# Altium schematic sheet LEDs.SchDoc
size A; SheetNumber: 5; SheetTotal: 10
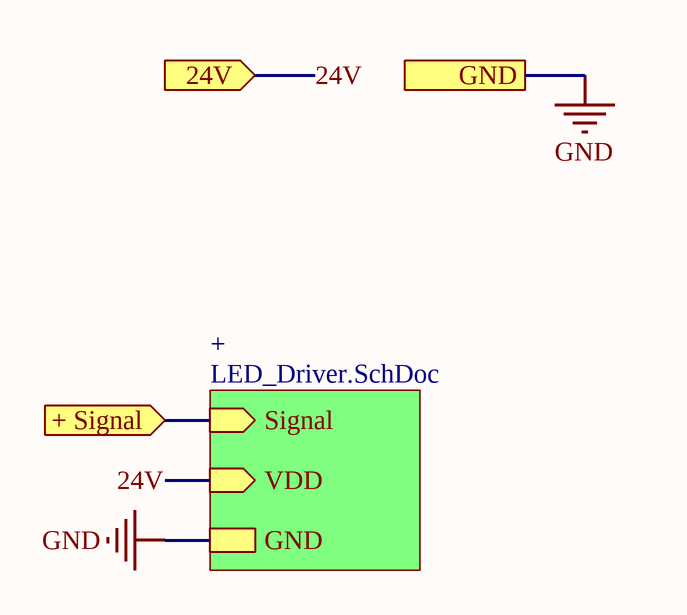
[diagram p0: LEDs.SchDoc]

## Sub-sheets
+ = LED_Driver.SchDoc: Signal (in), VDD (in), GND

## Ports
24V (in), + Signal (in), GND

## Nets
GND: port GND, sheet +/GND
24V: port 24V, sheet +/VDD
+ Signal: port + Signal, sheet +/Signal